# EAGLE design 3 LED Target (EAGLE 7.6.0)
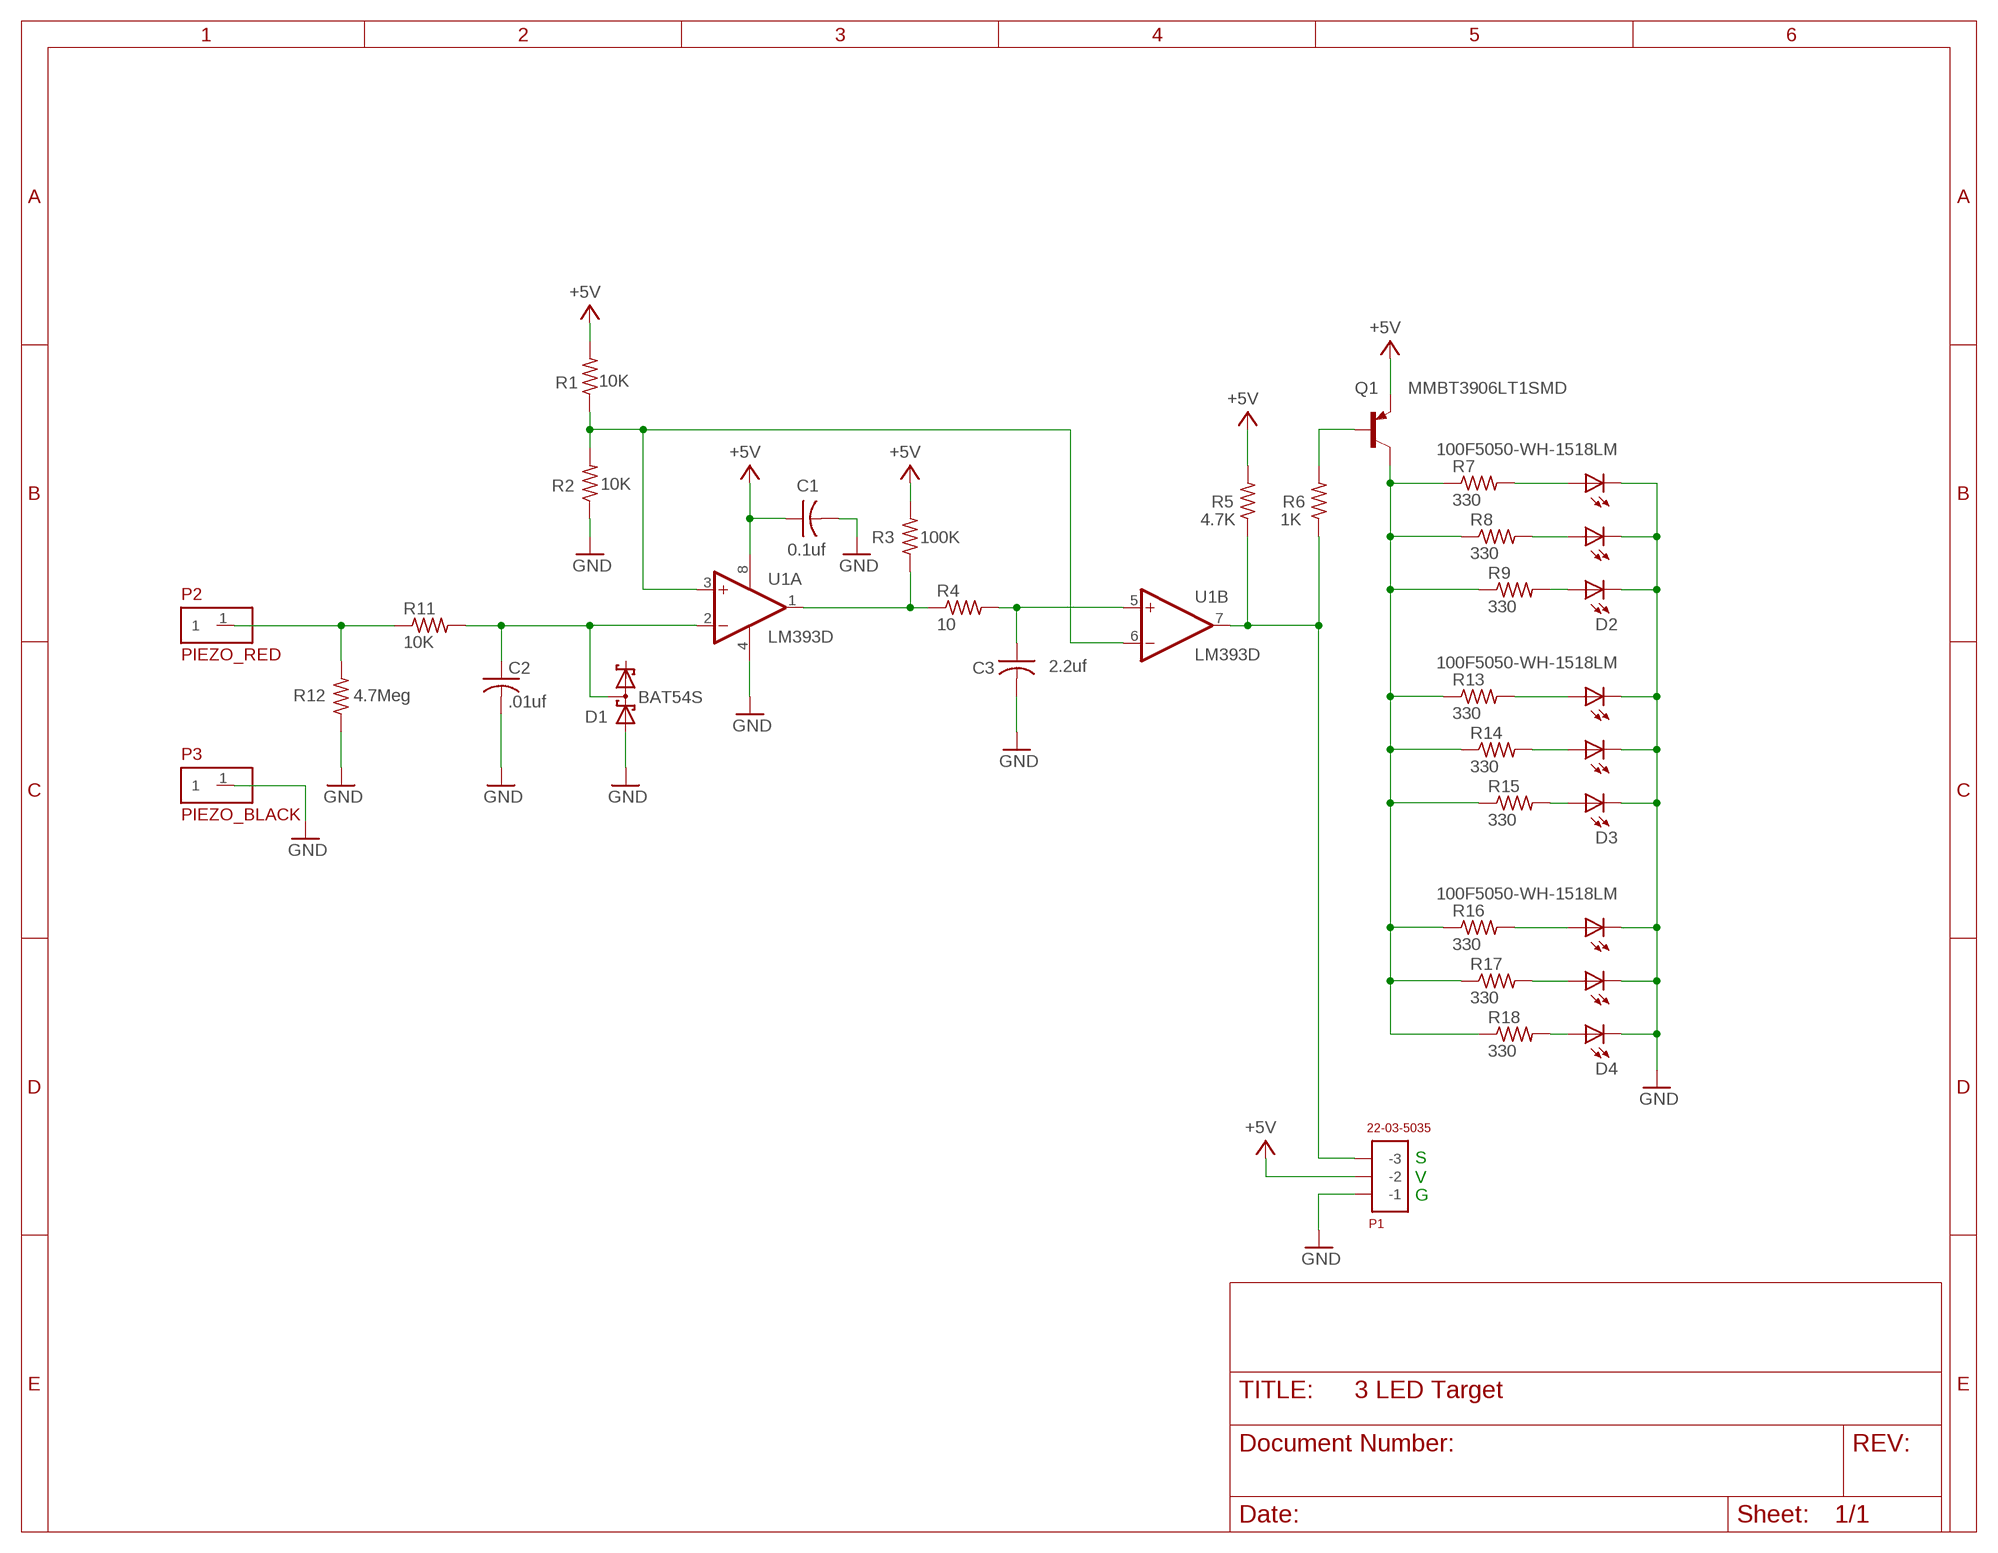
[diagram p0: schematic, sheet 1]

## Parts
C1  0.1uf  C-USC0603  [C0603]
C2  .01uf  C-USC0603  [C0603]
C3  2.2uf  C-USC1206  [C1206]
D1  BAT54S  [SOT23]
D2  100F5050-WH-1518LM  [LED5050]
D3  100F5050-WH-1518LM  [LED5050]
D4  100F5050-WH-1518LM  [LED5050]
P1  22-03-5035  [MOLEX3_STRAIGHT]
P2  PIEZO_RED  PINHOLE  [PADHOLE]
P3  PIEZO_BLACK  PINHOLE  [PADHOLE]
Q1  MMBT3906LT1SMD  [SOT23-BEC]
R1  10K  R-US_R0603  [R0603]
R2  10K  R-US_R0603  [R0603]
R3  100K  R-US_R0603  [R0603]
R4  10  R-US_R0603  [R0603]
R5  4.7K  R-US_R0603  [R0603]
R6  1K  R-US_R0603  [R0603]
R7  330  R-US_R0603  [R0603]
R8  330  R-US_R0603  [R0603]
R9  330  R-US_R0603  [R0603]
R11  10K  R-US_R0603  [R0603]
R12  4.7Meg  R-US_R0603  [R0603]
R13  330  R-US_R0603  [R0603]
R14  330  R-US_R0603  [R0603]
R15  330  R-US_R0603  [R0603]
R16  330  R-US_R0603  [R0603]
R17  330  R-US_R0603  [R0603]
R18  330  R-US_R0603  [R0603]
U1  LM393D  [SO08]

## Nets
+5V: C1.1 P1.2(-2) Q1.E R1.2 R3.2 R5.2 U1.8(P:V+)
GND: C1.2 C2.2 C3.2 D1.1(A1) D2.4(C2) D2.5(C1) D2.6(C) D3.4(C2) D3.5(C1) D3.6(C) D4.4(C2) D4.5(C1) D4.6(C) P1.1(-1) P3.1 R2.1 R12.1 U1.4(P:V-)
N$1: P2.1 R11.1 R12.2
N$2: C2.1 D1.3(C1A2) R11.2 U1.2(A:-IN)
N$3: R1.1 R2.2 U1.3(A:+IN) U1.6(B:-IN)
N$4: Q1.B R6.2
N$5: R3.1 R4.1 U1.1(A:OUT)
N$6: C3.1 R4.2 U1.5(B:+IN)
N$7: Q1.C R7.1 R8.1 R9.1 R13.1 R14.1 R15.1 R16.1 R17.1 R18.1
N$9: D2.1(A) R7.2
N$10: D2.2(A1) R8.2
N$11: D2.3(A2) R9.2
N$12: D3.1(A) R13.2
N$13: D3.2(A1) R14.2
N$14: D3.3(A2) R15.2
N$15: D4.1(A) R16.2
N$16: D4.2(A1) R17.2
N$17: D4.3(A2) R18.2
N$18: P1.3(-3) R5.1 R6.1 U1.7(B:OUT)
Unconnected: D1.2(C2)

## Notes on the sheet
- S
- V
- G

## Library data of the parts
C1-C3 = resistor:C-US: CAPACITOR, American symbol
D1 = diode:BAT54S: Schottky Diodes Pin connection corrected 2011-05-04 Source: Fairchild .. BAT54.pdf
D2-D4 = harkey_home:100F5050-WH-1518LM
P1 = harkey_home:22-03-5035
P2 P3 = harkey_home:PINHOLE
Q1 = transistor-pnp:MMBT3906*: PNP Transistror
R1-R9 R11-R18 = resistor:R-US_: RESISTOR, American symbol
U1 = linear:LM393: COMPARATOR

## Board
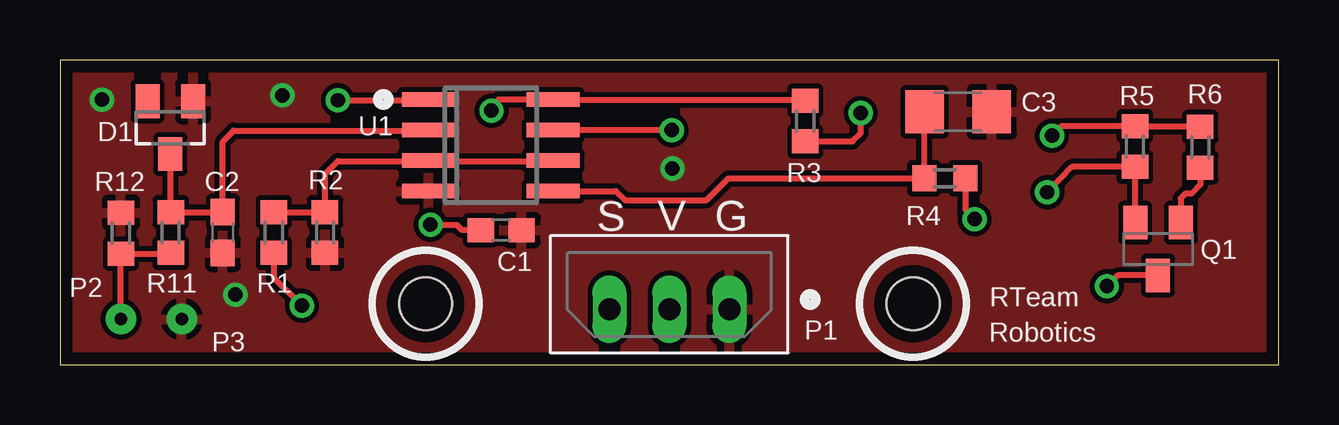
[diagram p1: board, top side]
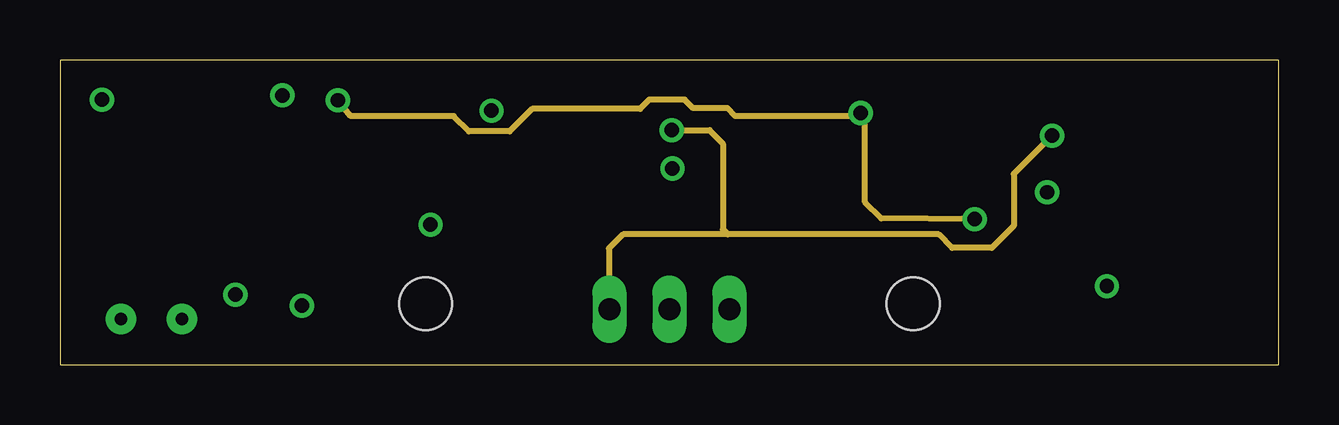
[diagram p2: board, inner layer Route2]
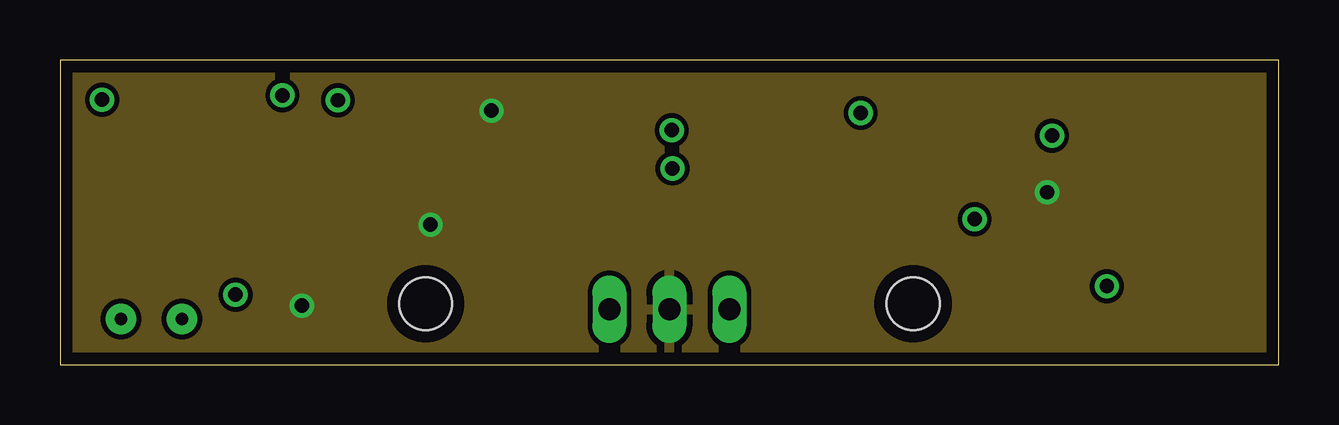
[diagram p3: board, inner layer Route15]
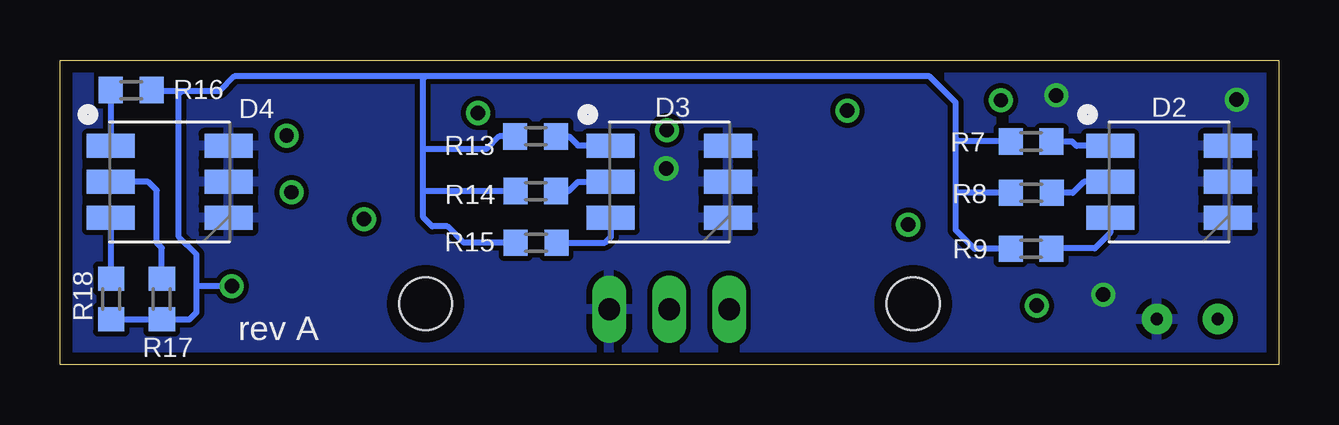
[diagram p4: board, bottom side, seen from below]

Size 50.8 x 12.7 mm. Coordinates in mm from the lower left corner, seen from the top.
Outline: 0,0 50.8,0 50.8,12.7 0,12.7 0,0
Copper layers (1*2+15*16): Top 0.035mm / dielectric 0.487mm / Route2 0.035mm / dielectric 0.487mm / Route15 0.035mm / dielectric 0.487mm / Bottom 0.035mm
Design rules "default *": minimum track width 10mil, minimum drill 10mil, track to track 8mil, track to pad 8mil, pad to pad 8mil, via to via 8mil, smd to smd 8mil, copper to edge 20mil, drill to drill 8mil, minimum pad ring 10mil, minimum via ring 8mil, stop-mask expansion 4mil, vias tented up to drill 0mil, thermal gap 10mil
Holes 2.2 mm at 15.24,2.54 35.56,2.54

### Footprints (pad centres in the part's own frame; a part is rotated, then mirrored left to right if it is on the bottom)
C0603 = smd 1.1 x 1: 1 -0.85,0; 2 0.85,0
C1206 = smd 1.6 x 1.8: 1 -1.4,0; 2 1.4,0
SOT23 = smd 1 x 1.4: 1 -0.95,-1.1; 2 0.95,-1.1; 3 0,1.1
LED5050 = smd 2 x 1: 1 -2.45,1.5; 2 -2.45,0; 3 -2.45,-1.5; 4 2.45,-1.5; 5 2.45,0; 6 2.45,1.5
MOLEX3_STRAIGHT = drill 0.9 long: 1 -2.505,-0.029; 2 -0.005,-0.029; 3 2.495,-0.029
PADHOLE = drill 0.508 pad 1.27: 1 0,0
SOT23-BEC = smd 1 x 1.4: B -0.95,-1.1; C 0,1.1; E 0.95,-1.1
R0603 = smd 1 x 1.1: 1 -0.85,0; 2 0.85,0
SO08 = smd 0.6 x 2.2: 1 -1.905,-2.6; 2 -0.635,-2.6; 3 0.635,-2.6; 4 1.905,-2.6; 5 1.905,2.6; 6 0.635,2.6; 7 -0.635,2.6; 8 -1.905,2.6

### Placement (x,y rotation side)
C1  18.39,5.61 0 top
C2  6.78,5.51 270 top
C3  37.44,10.54 0 top
D1  4.6,9.88 180 top
D2  4.57,7.62 0 bottom
D3  25.4,7.62 0 bottom
D4  46.23,7.62 0 bottom
P1  25.4,2.29 180 top
P2  2.54,1.91 0 top
P3  5.08,1.91 0 top
Q1  45.77,4.83 180 top
R1  8.92,5.51 270 top
R2  11.05,5.51 90 top
R3  31.06,10.16 90 top
R4  36.88,7.77 180 top
R5  44.81,9.09 270 top
R6  47.52,9.07 270 top
R7  10.32,9.31 0 bottom
R8  10.31,7.17 0 bottom
R9  10.32,4.84 0 bottom
R11  4.62,5.51 90 top
R12  2.54,5.49 270 top
R13  30.97,9.52 0 bottom
R14  30.96,7.24 0 bottom
R15  30.96,5.09 0 bottom
R16  47.83,11.44 180 bottom
R17  46.56,2.74 90 bottom
R18  48.67,2.74 90 bottom
U1  17.96,9.14 270 top

### Tracks (layer width: path | path; a pad name or v marks a point on that pad's centre or on a via)
+5V  (via drill 0.6)
  Top 0.254: Q1.E 44.81,5.94 R5.2 42.18,8.24 v41.15,7.19 | R1.2 8.91,3.63 v10.08,2.46 | v17.98,10.59 18.26,11.05 U1.8 31.02,11.05 R3.2 | C1.1 16.76,5.61 16.56,5.82 15.47,5.82 v15.44,5.84
  pour Route15: -1.09,13.54 51.74,13.54 51.74,-1.09 -1.24,-1.09 -1.24,13.64
GND  (via drill 0.6)
  other vias: 7.32,2.92 1.75,11.05 9.27,11.23 25.53,8.18
  pour Top: -0.64,13.79 51.71,13.79 51.71,-1.45 -0.69,-1.45 -0.69,13.84
  pour Bottom: -0.79,13.44 51.56,13.44 51.56,-1.98 -0.99,-1.98 -0.99,13.59
N$1
  Top 0.254: R11.1 4.6,4.64 R12.2 P2.1
N$2
  Top 0.254: D1.3 4.62,8.76 R11.2 C2.1 6.78,9.3 7.24,9.75 15.33,9.75 U1.2
N$3
  Top 0.254: R1.1 R2.2 11.05,7.95 11.58,8.48 15.33,8.48 U1.3 15.38,8.48 20.56,8.48
  Top 0.406: 20.56,8.48 U1.6
N$4
  Top 0.254: R6.2 47.52,7.49 47.17,7.14 46.91,7.14 46.71,6.93 Q1.B
N$5  (via drill 0.6)
  Top 0.254: R3.1 33.03,9.31 33.38,9.65 v33.38,10.49 | v11.58,11.02 15.33,11.02 U1.1 | R4.1 37.73,6.49 v38.12,6.07
  Route2 0.254: v11.58,11.02 12.12,10.36 16.41,10.36 17.04,9.73 18.75,9.73 19.68,10.67 24.18,10.67 24.56,11.05 26.04,11.05 26.39,10.69 27.81,10.69 28.14,10.36 33.25,10.36 v33.38,10.49 33.55,10.59 33.55,6.78 34.24,6.1 v38.12,6.07
N$6
  Top 0.254: C3.1 R4.2 27.86,7.77 26.95,6.86 23.55,6.86 23.16,7.24 U1.5
N$7  (via drill 0.6)
  Top 0.254: Q1.C 44.09,3.73 v43.64,3.28
  Bottom 0.254: R18.1 R17.1 45.4,1.89 45.11,2.18 45.11,3.3 | R9.1 12.68,4.83 13.46,5.61 13.46,7.19 | 13.46,7.19 13.46,9.42 | 13.46,9.42 13.46,10.92 14.55,12.01 35.56,12.01 | 35.56,12.01 43.54,12.01 44.15,11.4 45.72,11.4 | 45.72,11.4 46.94,11.4 R16.1 | 45.11,3.3 45.11,4.6 45.85,5.33 45.85,11.28 45.72,11.4 | R15.1 33.97,5.09 34.65,5.77 35.28,5.77 35.66,6.15 35.66,7.32 | 35.66,7.32 35.66,8.99 | 35.66,8.99 35.66,11.91 35.56,12.01 | R14.1 35.58,7.24 35.66,7.32 | R13.1 32.49,9.52 33.02,8.99 35.66,8.99 | R8.1 13.45,7.17 13.46,7.19 | R7.1 13.34,9.31 13.46,9.42 | v43.64,3.28 45.09,3.28 45.11,3.3
N$9
  Bottom 0.254: D2.1 8.43,9.12 8.61,9.3 9.46,9.3 R7.2
N$10
  Bottom 0.254: D2.2 8.13,7.62 8.59,7.16 R8.2
N$11
  Bottom 0.254: D2.3 7.02,5.5 7.67,4.85 9.46,4.85 R9.2
N$12
  Bottom 0.254: R13.2 29.59,9.52 29.21,9.14 27.87,9.14 D3.1
N$13
  Bottom 0.254: R14.2 29.59,7.24 29.21,7.62 D3.2
N$14
  Bottom 0.254: D3.3 27.84,6.11 27.84,5.33 28.09,5.09 R15.2
N$15
  Bottom 0.254: R16.2 D4.1 | D4.1
N$16
  Bottom 0.254: R17.2 46.56,4.88 46.76,5.08 46.76,7.26 47.12,7.62 D4.2
N$17
  Bottom 0.254: R18.2 48.67,6.11 D4.3
N$18  (via drill 0.6)
  Top 0.254: R6.1 47.5,9.94 R5.1 44.79,9.93 41.73,9.93 v41.35,9.55 | v25.5,9.78 U1.7
  Route2 0.254: 25.53,9.8 v25.5,9.78 27.08,9.78 27.64,9.22 27.64,5.64 27.84,5.44 | v41.35,9.55 39.75,7.95 39.75,5.79 38.84,4.88 37.19,4.88 36.63,5.44 27.84,5.44 | 27.84,5.44 23.47,5.44 22.89,4.85 22.89,2.33 P1.3

### Text on the board
tPlace: S | V | G | RTeam | Robotics
bPlace: rev A